# Altium schematic sheet Power.SchDoc: Power
size A4; DrawnBy: IPE; Engineer: IPE; Address1: ETML-ES; Address2: Rue de Sébeillon 12; Address3: 1004 Lausanne; Revision: v0.1; SheetNumber: 2; SheetTotal: 3
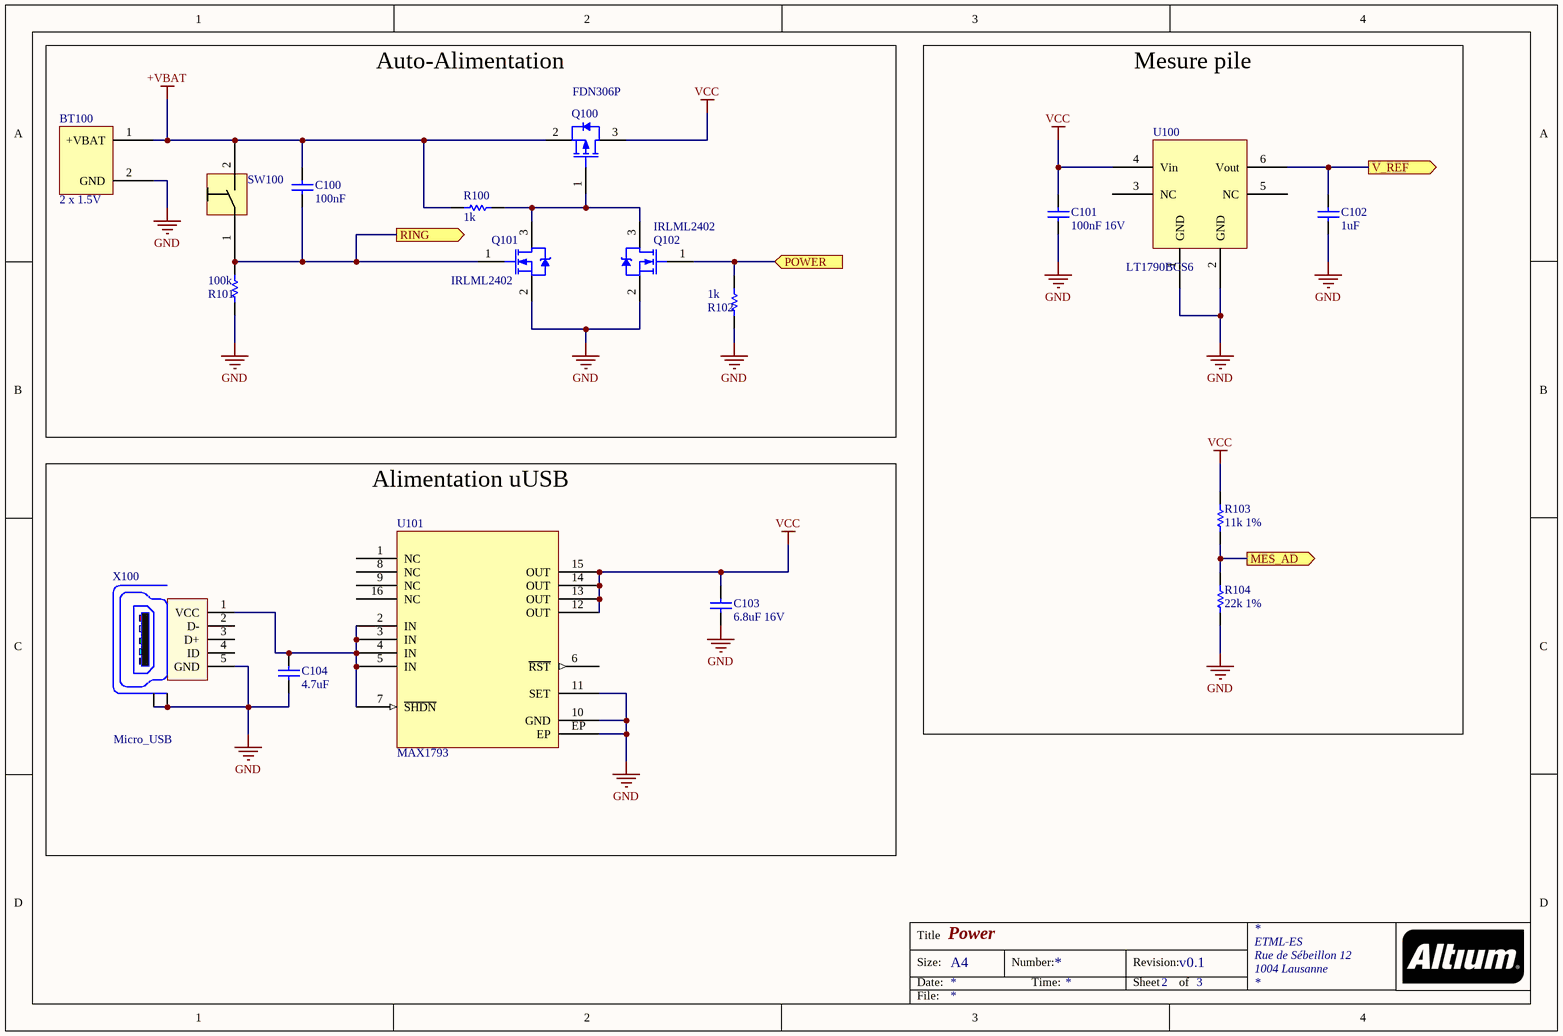
[diagram p0: Power.SchDoc]

## Parts
BT100  2 x 1.5V  [BatterySupport]
C100  100nF  [CAPC2013X100X20NL20]
C101  100nF 16V  [CAPC0805(2012)145_M]
C102  1uF  [CAPC2013X145X50ML20T25]
C103  6.8uF 16V  [CAPC0805(2012)145_L]
C104  4.7uF  [CAPC2013X135X45LL10T25]
Q100  FDN306P  [FAIR-SSOT3L-3_V]
Q101  IRLML2402  [INTR-IRLML2402TRPBF-3_V]
Q102  IRLML2402  [INTR-IRLML2402TRPBF-3_V]
R100  1k  [RESC2013X60X35ML10T20]
R101  100k  [RESC2013X60X35ML10T20]
R102  1k  [RESC2013X60X35ML10T20]
R103  11k 1%  [RESC0805(2012)_N]
R104  22k 1%  [RESC0805(2012)_L]
SW100  Poussoir  [Switch_Schurter]  (value not drawn)
U100  LT1790BCS6  [SOT-23]
U101  MAX1793  [TSOP65P640X110_HS-17N]
X100  Micro_USB  [Micro_USB]

## Ports
MES_AD (out), POWER (in), RING (out), V_REF (out)

## Nets
+VBAT: BT100.1(+VBAT) C100.2 Q100.2(SOURCE) R100.2 SW100.2
GND: BT100.2(GND) C101.1 C102.1 C103.1 C104.1 Q101.2(S) Q102.2(S) R101.1 R102.1 R104.1 U100.1(GND) U100.2(GND) U101.10(GND) U101.11(SET) U101.EP X100.5(GND) X100.Z1(Shield) X100.Z2(Shield)
VCC: C101.2 C103.2 Q100.3(DRAIN) R103.2 U100.4(Vin) U101.12(OUT) U101.13(OUT) U101.14(OUT) U101.15(OUT)
MES_AD: R103.1 R104.2 ; port MES_AD
POWER: Q102.1(G) R102.2 ; port POWER
RING: C100.1 Q101.1(G) R101.2 SW100.1 ; port RING
V_REF: C102.2 U100.6(Vout) ; port V_REF
NetC104_2: C104.2 U101.2(IN) U101.3(IN) U101.4(IN) U101.5(IN) U101.7(~{SHDN}) X100.1(VCC)
NetQ100_1: Q100.1(GATE) Q101.3(D) Q102.3(D) R100.1

Not connected (* = marked no-connect by the designer): U100 3(NC) 5(NC); U101 1(NC) 6(~{RST}) 8(NC) 9(NC) 16(NC); X100 2(D-) 3(D+) 4(ID)

## Notes on the sheet
- Auto-Alimentation
- Mesure pile
- Alimentation uUSB
- Title
- Size:
- Date:
- A4
- Number:
- Time:
- Revision:
- Sheet
- of
- File:

## Library data of the parts
BT100 = Battery connector AAA: Battery Support 2x1.5V type AAA; Manufacturer: Keystone Electronics; PartNumber: 1022; Value: 2x 1V5; Supplier: Digi-key; Supplier PN: 36-1022-ND
C100 = CMP-1663-00007-1: Chip Capacitor, 100 nF, +/- 10%, 16 V, -55 to 85 degC, 0805 (2012 Metric), RoHS, Tape and Reel; Voltage Rating: 16 V; PackageCase: 0805; Value: 100 nF
C101 = CMP-1036-04404-1: CAP 100nF 16V ±20% 0805 (2012 Metric) Thickness 1.45mm SMD; Value: 100nF; PackageCase: 0805
C102 = CMP-2100-03605-1: Chip Capacitor, 1 uF, 25 V, 10%, -55 to 125 degC, 0805 (2012 Metric), RoHS, Tape and Reel; Voltage Rating: 25V; PackageCase: 0805; Value: 1uF
C103 = CMP-1036-04912-1: CAP 6.8uF 16V ±20% 0805 (2012 Metric) Thickness 1.45mm SMD; Value: 6.8uF; PackageCase: 0805
C104 = CMP-1662-00015-2: Chip Capacitor, 4.7 uF, +/- 10%, 16 V, -55 to 85 degC, 0805 (2012 Metric), RoHS, Tape and Reel; PartNumber: GRM21BR61C475KA88L; Voltage Rating: 16 V; PackageCase: 0805; Value: 4.7 uF
Q100 = CMP-2000-06248-1: P-Channel Specified Power Trench (R) MOSFET, 1.8 V, -55 to 150 degC, 3-Pin SOT, RoHS, Tape and Reel; Manufacturer: ON Semiconductor; PackageCase: SSOT-3; PartNumber: FDN306P; Supplier: Digi-key; Supplier PN: FDN306PCT-ND
Q101 Q102 = CMP-2000-05155-1: HEXFET(R) Power MOSFET, N-Channel, 20 V, 1.2 A, 3-Pin SOT-23, RoHS, Tape and Reel; Manufacturer: Infineon Technologies; PartNumber: IRLML2402TRBF; PackageCase: SOT-23; Supplier: Digi-key; Supplier PN: IRLML2402PBFCT-ND
R100 R102 = CMP-2100-03671-1: Chip Resistor, 1 KOhm, +/- 1%, 125 mW, -55 to 155 degC, 0805 (2012 Metric), RoHS, Tape and Reel; Voltage Rating: 150V; PackageCase: 0805; Value: 1k
R101 = CMP-2100-03671-1: Chip Resistor, 100 KOhm, +/- 1%, 125 mW, -55 to 155 degC, 0805 (2012 Metric), RoHS, Tape and Reel; Voltage Rating: 150V; PackageCase: 0805; Value: 100k
R103 = CMP-1013-00075-1: 11k 0.125W 0805 (2012 Metric)  SMD; Value: 1100.00 Ohm; PackageCase: 0805
R104 = CMP-1013-00082-1: 22k 0.125W  0805 (2012 Metric)  SMD; Value: 2200.00 Ohm; PackageCase: 0805
SW100 = Switch_Schurter: Switch 12.7x12.7x17.5; Manufacturer: Schurter
U100 = LT1790: IC VREF SERIES 2.048V SOT23-6; Manufacturer: Linear Technology; PartNumber: LT1790BCS6-2.048#TRMPBF; Supplier: Digi-key; Supplier PN: LT1790BCS6-2.048#TRMPBFCT-ND; PackageCase: SOT-23
U101 = MAX1793: IC REG LINEAR POS ADJ 1A 16TSSOP; Manufacturer: Maxim Integrated
X100 = WR-Communication Connectors 629105150521: WR-COM_USB_Micro Type B_Horizontal_SMT; Manufacturer: Würth Elektronik eiSos GmbH; Voltage Rating: 5V; PartNumber: 629105150521; Supplier: Digi-key; Supplier PN: 732-5960-1-ND